# EAGLE design icsp_adapt (EAGLE 6.3)
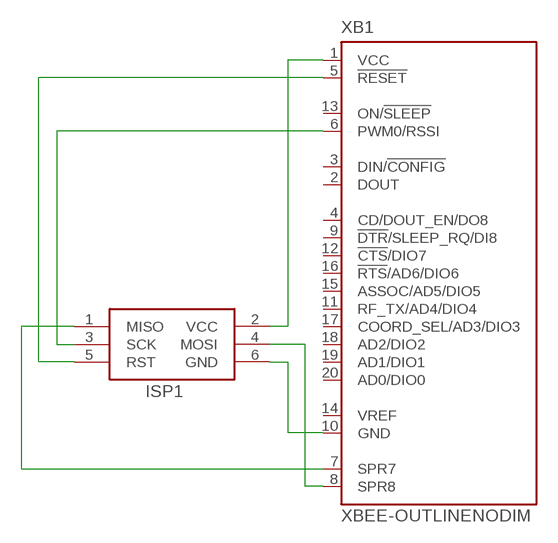
[diagram p0: schematic, sheet 1]

## Parts
ISP1  AVRISP-6  [AVRISP]
XB1  XBEE-OUTLINENODIM  [XBEE-PRO-NO_DIM]

## Nets
GND: ISP1.6(GND) XB1.10(GND)
N$2: ISP1.2(VCC) XB1.1(VCC)
N$3: ISP1.4(MOSI) XB1.8(SPR8)
N$4: ISP1.1(MISO) XB1.7(SPR7)
N$5: ISP1.3(SCK) XB1.6(PWM0/RSSI)
N$6: ISP1.5(RST) XB1.5(!RESET)
Unconnected: XB1.2(DOUT) XB1.3(DIN/!CONFIG) XB1.4(CD/DOUT_EN/DO8) XB1.9(!DTR!/SLEEP_RQ/DI8) XB1.11(RF_TX/AD4/DIO4) XB1.12(!CTS!/DIO7) XB1.13(ON/!SLEEP) XB1.14(VREF) XB1.15(ASSOC/AD5/DIO5) XB1.16(!RTS!/AD6/DIO6) XB1.17(COORD_SEL/AD3/DIO3) XB1.18(AD2/DIO2) XB1.19(AD1/DIO1) XB1.20(AD0/DIO0)

## Library data of the parts
ISP1 = adafruit:AVRISP: AVR ISP HEADER Standard 6 pin header for AVR programming
XB1 = mylib:XBEE-OUTLINE: XBee (TM) /XBee-PRO(TM) OEM RF Modules Source: MaxStream, Inc. xbee_productmanual.pdf

## Board
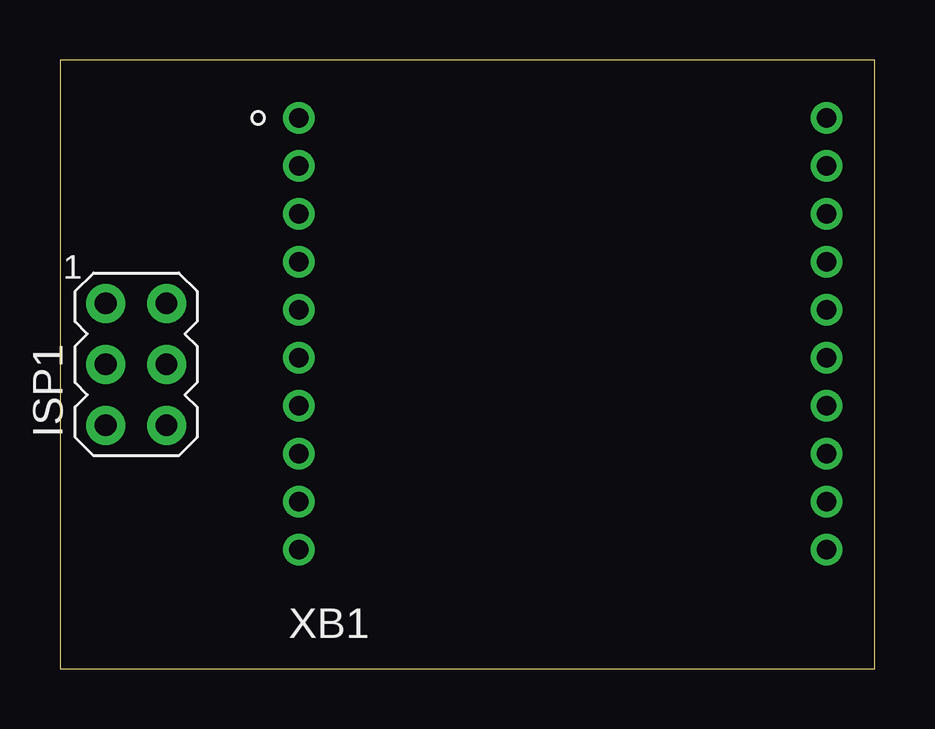
[diagram p1: board, top side]
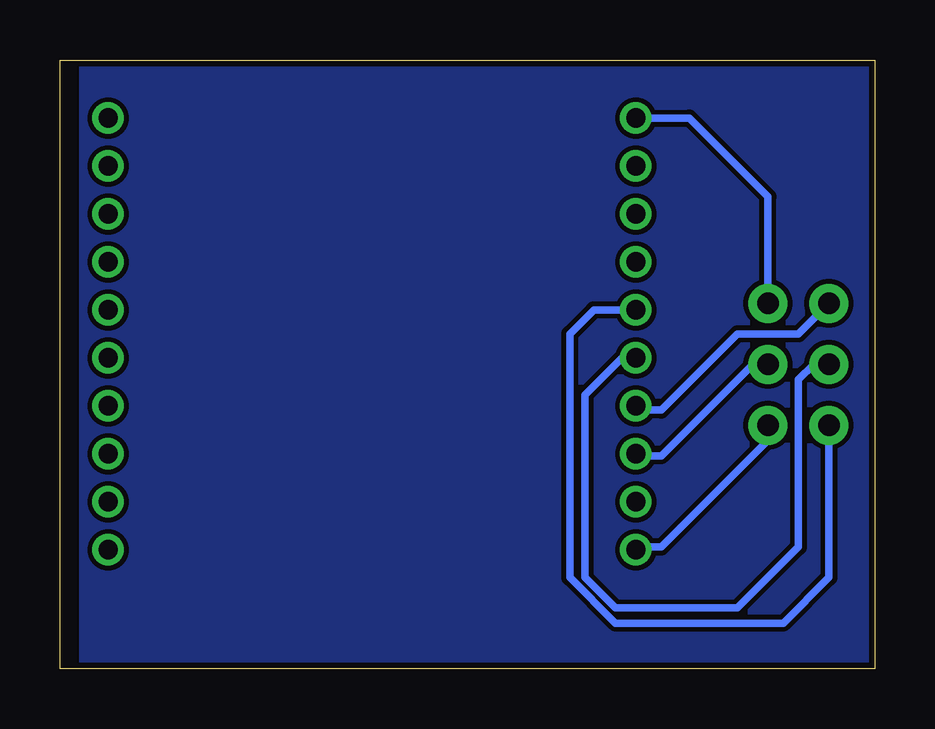
[diagram p2: board, bottom side, seen from below]

Size 33.96 x 25.39 mm. Coordinates in mm from the lower left corner, seen from the top.
Outline: 0,0 33.96,0 33.96,25.39 0,25.39 0,0
Copper layers (1*16): Top 0.035mm / dielectric 1.5mm / Bottom 0.035mm
Design rules "default *": minimum track width 10mil, minimum drill 24mil, track to track 8mil, track to pad 8mil, pad to pad 8mil, via to via 8mil, smd to smd 8mil, copper to edge 10mil, drill to drill 8mil, minimum pad ring 10mil, minimum via ring 8mil, stop-mask expansion 4mil, vias tented up to drill 0mil, thermal gap 10mil

### Footprints (pad centres in the part's own frame; a part is rotated, then mirrored left to right if it is on the bottom)
AVRISP = drill 0.9 pad 1.626: 1 -1.27,2.54; 2 1.27,2.54; 3 -1.27,0; 4 1.27,0; 5 -1.27,-2.54; 6 1.27,-2.54
XBEE-PRO-NO_DIM = drill 0.8 pad 1.27: 1 -11,9; 2 -11,7; 3 -11,5; 4 -11,3; 5 -11,1; 6 -11,-1; 7 -11,-3; 8 -11,-5; 9 -11,-7; 10 -11,-9; 11 11,-9; 12 11,-7; 13 11,-5; 14 11,-3; 15 11,-1; 16 11,1; 17 11,3; 18 11,5; 19 11,7; 20 11,9

### Placement (x,y rotation side)
ISP1  3.17,12.7 0 top
XB1  20.95,13.97 0 top

### Tracks (layer width: path | path; a pad name or v marks a point on that pad's centre or on a via)
GND
  Bottom 0.305: ISP1.6 4.45,9.53 8.89,5.08 9.85,5.08 XB1.10
N$1
  pour Bottom: 0,25.4 33.02,25.4 33.02,0 0,0
N$2
  Bottom 0.305: ISP1.2 4.45,19.68 7.73,22.97 XB1.1
N$3
  Bottom 0.305: ISP1.4 5.08,12.7 8.89,8.89 9.88,8.89 XB1.8
N$4
  Bottom 0.305: ISP1.1 3.17,13.97 5.71,13.97 8.89,10.79 9.78,10.79 XB1.7
N$5
  Bottom 0.305: XB1.6 10.53,12.97 12.06,11.43 12.06,3.81 10.79,2.54 5.71,2.54 3.17,5.08 3.17,12.06 2.54,12.7 ISP1.3
N$6
  Bottom 0.305: ISP1.5 1.91,3.81 3.81,1.91 10.79,1.91 12.7,3.81 12.7,13.97 11.7,14.97 XB1.5